# Altium schematic sheet bridge.SchDoc
size 431 x 279 mm; Date: Not shown in title block; ApprovedBy: Not shown in title block; CheckedBy: Not shown in title block; Author: Not shown in title block; CompanyName: Not shown in title block; Engineer: Not shown in title block; Organization: Not shown in title block; Address1: Not shown in title block; Address2: Not shown in title block; Address3: Not shown in title block; Address4: Not shown in title block; DocumentNumber: 3; Revision: Use project parameter SCH_Rev; SheetNumber: 3; SheetTotal: 6; PageSetup: Record=PageOptions|CenterHorizontal=True|CenterVertical=True|PrintScale=1.00|XCorrection=1.00|YCorrection=1.00|PrintKind=0|BorderSize=5000000|LeftOffset=0|BottomOffset=0|Orientation=2|PaperLength=1000|PaperWidth=1000|Scale=100|PaperSource=15|PrintQuality=600|MediaType=1|DitherType=10|PaperKind=Letter|PrintScaleMode=1; CurrentTime: Not shown in title block; CurrentDate: Not shown in title block; Time: Not shown in title block; DocumentFullPathAndName: Not shown in title block; DocumentName: Not shown in title block; ModifiedDate: Not shown in title block; ImagePath: Not shown in title block
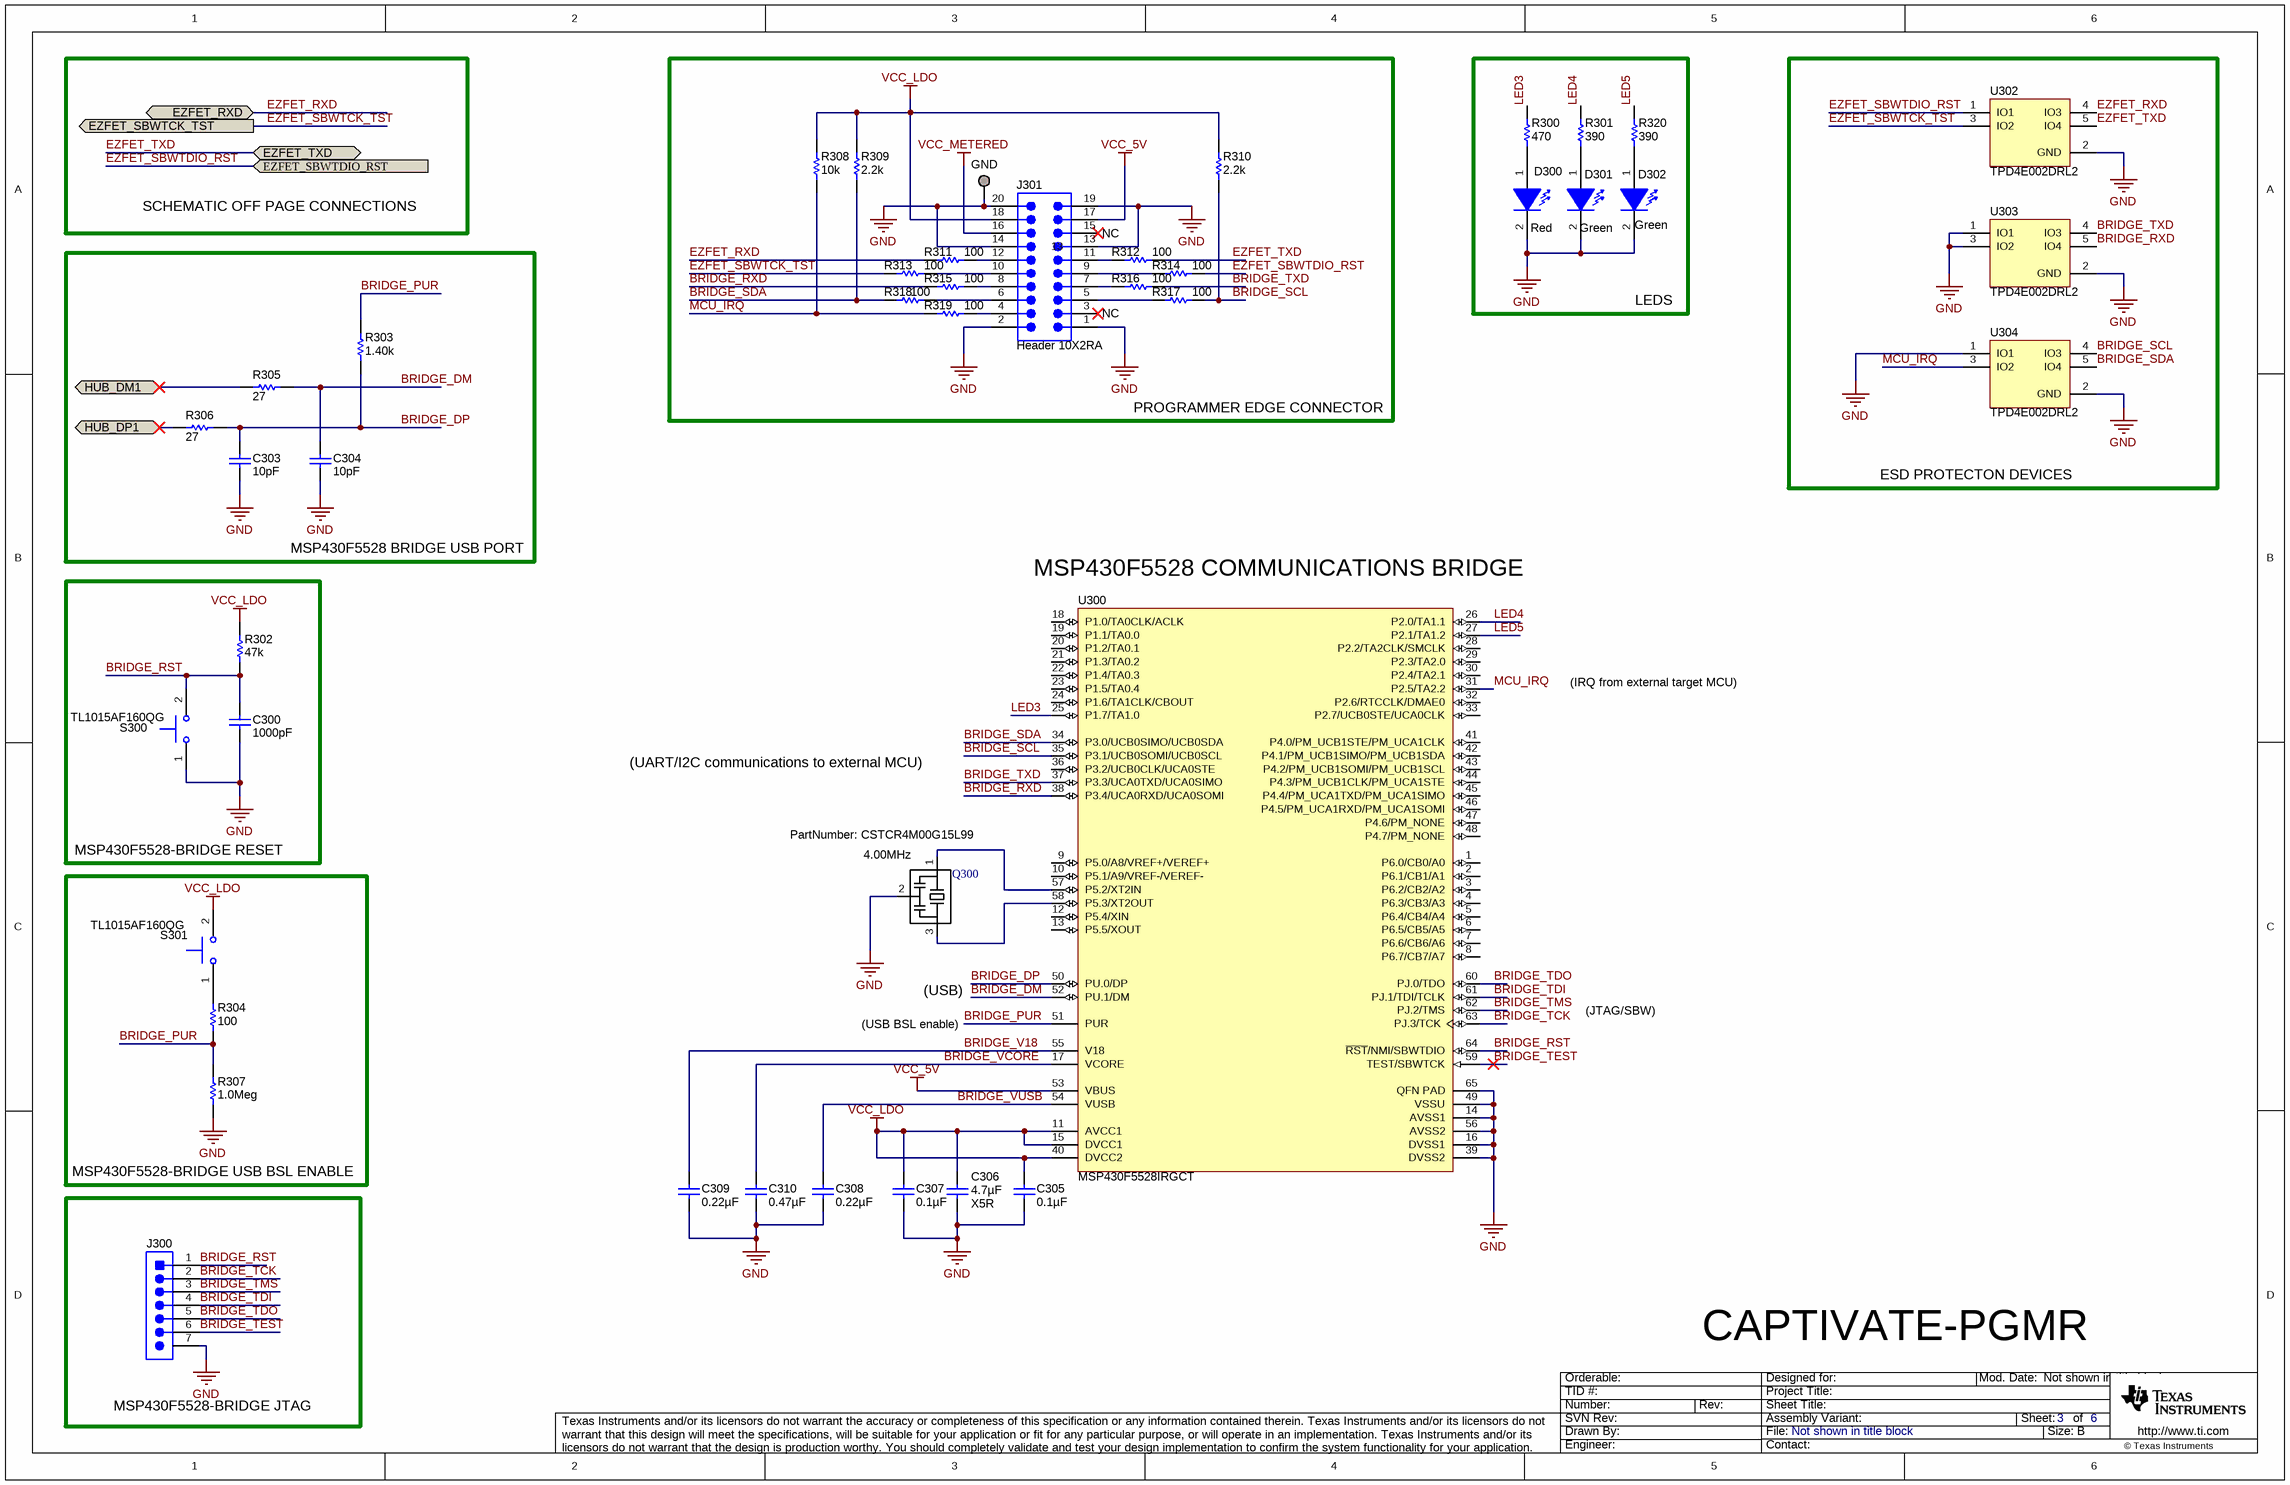
[diagram p0: bridge.SchDoc]

## Parts
C300  ValueDisplayed: 1000pF  [0402]  (hidden comment: C1005X7R1H102K)
C303  ValueDisplayed: 10pF  [0402]  (hidden comment: GRM1555C1H100JA01D)
C304  ValueDisplayed: 10pF  [0402]  (hidden comment: GRM1555C1H100JA01D)
C305  ValueDisplayed: 0.1µF  [0402]  (hidden comment: GRM155R61C104KA88D)
C306  ValueDisplayed: 4.7µF  TempCo: X5R  [0603]  (hidden comment: CGB3B1X5R1A475K055AC)
C307  ValueDisplayed: 0.1µF  [0402]  (hidden comment: GRM155R61C104KA88D)
C308  ValueDisplayed: 0.22µF  [0402]  (hidden comment: GRM155R61A224KE19D)
C309  ValueDisplayed: 0.22µF  [0402]  (hidden comment: GRM155R61A224KE19D)
C310  ValueDisplayed: 0.47µF  [0402]  (hidden comment: GRM155R61A474KE15D)
D300  value Red  [LED_LTST-C190_Red]  (hidden comment: LTST-C190CKT)
D301  value Green  [LED_LTST-C190]  (hidden comment: LTST-C190GKT)
D302  value Green  [LED_LTST-C190]  (hidden comment: LTST-C190GKT)
GND  TESTPOINT  [TP_VIA_060RND040]  (value not drawn)  (no BOM)
J300  GRPB071VWVN-RC  [Sullins_GRPB071VWVN-RC]  (value not drawn)
J301  Header 10X2RA  [HDR2X10RA]
Q300  Value Displayed: 4.00MHz  PartNumber: CSTCR4M00G15L99  [CSTCR CERAMIC RESONATOR - MURATA]  (hidden comment: RATA-FILTER_CSTCR4M00G15)
R300  value 470  [0402]  (hidden comment: CRCW0402470RJNED)
R301  value 390  [0402]  (hidden comment: CRCW0402390RJNED)
R302  value 47k  [0402]  (hidden comment: CRCW040247K0JNED)
R303  value 1.40k  [0402]  (hidden comment: CRCW04021K40FKED)
R304  value 100  [0402]  (hidden comment: CRCW0402100RJNED)
R305  value 27  [0402]  (hidden comment: CRCW040227R0JNED)
R306  value 27  [0402]  (hidden comment: CRCW040227R0JNED)
R307  value 1.0Meg  [0402]  (hidden comment: CRCW04021M00JNED)
R308  ValueDisplayed: 10k  [0402]  (hidden comment: CRCW040210K0JNED)
R309  ValueDisplayed: 2.2k  [0402]  (hidden comment: CRCW04022K20JNED)
R310  ValueDisplayed: 2.2k  [0402]  (hidden comment: CRCW04022K20JNED)
R311  ValueDisplayed: 100  [0402]  (hidden comment: CRCW0402100RJNED)
R312  ValueDisplayed: 100  [0402]  (hidden comment: CRCW0402100RJNED)
R313  ValueDisplayed: 100  [0402]  (hidden comment: CRCW0402100RJNED)
R314  ValueDisplayed: 100  [0402]  (hidden comment: CRCW0402100RJNED)
R315  ValueDisplayed: 100  [0402]  (hidden comment: CRCW0402100RJNED)
R316  ValueDisplayed: 100  [0402]  (hidden comment: CRCW0402100RJNED)
R317  ValueDisplayed: 100  [0402]  (hidden comment: CRCW0402100RJNED)
R318  ValueDisplayed: 100  [0402]  (hidden comment: CRCW0402100RJNED)
R319  ValueDisplayed: 100  [0402]  (hidden comment: CRCW0402100RJNED)
R320  value 390  [0402]  (hidden comment: CRCW0402390RJNED)
S300  TL1015AF160QG  [SW_TL1015AF160QG]
S301  TL1015AF160QG  [SW_TL1015AF160QG]
U300  MSP430F5528IRGCT  [RGC0064B]
U302  TPD4E002DRL2  [DRL0005A]
U303  TPD4E002DRL2  [DRL0005A]
U304  TPD4E002DRL2  [DRL0005A]

## Blocks framed on the sheet
PROGRAMMER EDGE CONNECTOR: GND J301 R308-R319
LEDS: D300-D302 R300 R301 R320
ESD PROTECTON DEVICES: U302-U304
MSP430F5528 BRIDGE USB PORT: C303 C304 R303 R305 R306
MSP430F5528-BRIDGE RESET: C300 R302 S300
MSP430F5528-BRIDGE USB BSL ENABLE: R304 R307 S301
MSP430F5528-BRIDGE JTAG: J300

## Ports
EZFET_RXD (bidir), EZFET_SBWTCK_TST, EZFET_SBWTDIO_RST, EZFET_TXD (bidir), HUB_DM1 (bidir), HUB_DP1 (bidir)

## Nets
GND: C300.2 C303.2 C304.2 C305.2 C306.2 C307.2 C308.2 C309.2 C310.2 D300.2(K) D301.2(K) D302.2(K) GND.1 J300.7 J301.1 J301.2 J301.13 J301.14 J301.19 J301.20 Q300.2 R307.1 S300.1 U300.14(AVSS1) U300.16(DVSS1) U300.39(DVSS2) U300.49(VSSU) U300.56(AVSS2) U300.65(QFN_PAD) U302.2(GND) U303.1(IO1) U303.2(GND) U303.3(IO2) U304.1(IO1) U304.2(GND)
VCC_5V: J301.17 U300.53(VBUS)
VCC_LDO: C305.1 C306.1 C307.1 J301.18 R302.2 R308.2 R309.2 R310.1 S301.2 U300.11(AVCC1) U300.15(DVCC1) U300.40(DVCC2)
VCC_METERED: J301.16
BRIDGE_DM: C304.1 R305.2 U300.52(PU.1/DM)
BRIDGE_DP: C303.1 R303.1 R306.2 U300.50(PU.0/DP)
BRIDGE_PUR: R303.2 R304.1 R307.2 U300.51(PUR)
BRIDGE_RST: C300.1 J300.1 R302.1 S300.2 U300.64(~{RST}/NMI/SBWTDIO)
BRIDGE_RXD: R315.1 U300.38(P3.4/UCA0RXD/UCA0SOMI) U303.5(IO4)
BRIDGE_SCL: R310.2 R317.2 U300.35(P3.1/UCB0SOMI/UCB0SCL) U304.4(IO3)
BRIDGE_SDA: R309.1 R318.1 U300.34(P3.0/UCB0SIMO/UCB0SDA) U304.5(IO4)
BRIDGE_TCK: J300.2 U300.63(PJ.3/TCK)
BRIDGE_TDI: J300.4 U300.61(PJ.1/TDI/TCLK)
BRIDGE_TDO: J300.5 U300.60(PJ.0/TDO)
BRIDGE_TEST: J300.6 U300.59(TEST/SBWTCK)
BRIDGE_TMS: J300.3 U300.62(PJ.2/TMS)
BRIDGE_TXD: R316.2 U300.37(P3.3/UCA0TXD/UCA0SIMO) U303.4(IO3)
BRIDGE_V18: C309.1 U300.55(V18)
BRIDGE_VCORE: C310.1 U300.17(VCORE)
BRIDGE_VUSB: C308.1 U300.54(VUSB)
EZFET_RXD: R311.1 U302.4(IO3) ; port EZFET_RXD
EZFET_SBWTCK_TST: R313.1 U302.3(IO2) ; port EZFET_SBWTCK_TST
EZFET_SBWTDIO_RST: R314.2 U302.1(IO1) ; port EZFET_SBWTDIO_RST
EZFET_TXD: R312.2 U302.5(IO4) ; port EZFET_TXD
HUB_DM1: R305.1 ; port HUB_DM1
HUB_DP1: R306.1 ; port HUB_DP1
LED3: R300.2 U300.25(P1.7/TA1.0)
LED4: R301.2 U300.26(P2.0/TA1.1)
LED5: R320.2 U300.27(P2.1/TA1.2)
MCU_IRQ: R308.1 R319.1 U300.31(P2.5/TA2.2) U304.3(IO2)
NetD300_1: D300.1(A) R300.1
NetD301_1: D301.1(A) R301.1
NetD302_1: D302.1(A) R320.1
NetJ301_4: J301.4 R319.2
NetJ301_5: J301.5 R317.1
NetJ301_6: J301.6 R318.2
NetJ301_7: J301.7 R316.1
NetJ301_8: J301.8 R315.2
NetJ301_9: J301.9 R314.1
NetJ301_10: J301.10 R313.2
NetJ301_11: J301.11 R312.1
NetJ301_12: J301.12 R311.2
NetQ300_1: Q300.1 U300.57(P5.2/XT2IN)
NetQ300_3: Q300.3 U300.58(P5.3/XT2OUT)
NetR304_2: R304.2 S301.1

Not connected (* = marked no-connect by the designer): J301 3* 15*; U300 1(P6.0/CB0/A0) 2(P6.1/CB1/A1) 3(P6.2/CB2/A2) 4(P6.3/CB3/A3) 5(P6.4/CB4/A4) 6(P6.5/CB5/A5) 7(P6.6/CB6/A6) 8(P6.7/CB7/A7) 9(P5.0/A8/VREF+/VEREF+) 10(P5.1/A9/VREF-/VEREF-) 12(P5.4/XIN) 13(P5.5/XOUT) 18(P1.0/TA0CLK/ACLK) 19(P1.1/TA0.0) 20(P1.2/TA0.1) 21(P1.3/TA0.2) 22(P1.4/TA0.3) 23(P1.5/TA0.4) 24(P1.6/TA1CLK/CBOUT) 28(P2.2/TA2CLK/SMCLK) 29(P2.3/TA2.0) 30(P2.4/TA2.1) 32(P2.6/RTCCLK/DMAE0) 33(P2.7/UCB0STE/UCA0CLK) 36(P3.2/UCB0CLK/UCA0STE) 41(P4.0/PM_UCB1STE/PM_UCA1CLK) 42(P4.1/PM_UCB1SIMO/PM_UCB1SDA) 43(P4.2/PM_UCB1SOMI/PM_UCB1SCL) 44(P4.3/PM_UCB1CLK/PM_UCA1STE) 45(P4.4/PM_UCA1TXD/PM_UCA1SIMO) 46(P4.5/PM_UCA1RXD/PM_UCA1SOMI) 47(P4.6/PM_NONE) 48(P4.7/PM_NONE)

## Notes on the sheet
- SCHEMATIC OFF PAGE CONNECTIONS
- NC
- (near U300) MSP430F5528 COMMUNICATIONS BRIDGE
- (IRQ from external target MCU)
- (UART/I2C communications to external MCU)
- (USB BSL enable)
- (USB)
- (JTAG/SBW)
- CAPTIVATE-PGMR
- Drawn By:
- SVN Rev:
- Number:
- TID #:
- Orderable:
- Rev:
- Sheet Title:
- File:
- Project Title:
- Designed for:
- Assembly Variant:
- Mod. Date:
- Sheet:
- Size:
- of
- B
- http://www.ti.com
- Texas Instruments and/or its licensors do not warrant the accuracy or completeness of this specification or any information contained therein. Texas Instruments and/or its licensors do not warrant that this design will meet the specifications, will be suitable for your application or fit for any particular purpose, or will operate in an implementation. Texas Instruments and/or its licensors do not warrant that the design is production worthy. You should completely validate and test your design implementation to confirm the system functionality for your application.
- Engineer:
- Contact:
- © Texas Instruments

## Library data of the parts
C300 = C1005X7R1H102K: CAP, CERM, 1000pF, 50V, +/-10%, X7R, 0402; Manufacturer: TDK; Polarized: N; CompType: Capacitor; U/M: EA; Cap_F: 0.000000001; Tolerance_%: 10; ESR_Ohm: 0.2381; Value1: 0.2381 ohm; VDC_V: 50; TaMin_C: -55; TaMax_C: 125; SymbolVersion: 2008-07-09; Value: 1000pF; PartNumber: C1005X7R1H102K; PackageReference: 0402; RoHS: Y; Value2: 50V; MountType: SMT; Technology: Ceramic; TempCo: X7R; Cap_Case: 0402; Published: 2008-06-19; Publisher: Texas Instruments; LatestRevisionDate: 2013-09-06; ComponentLink1Description: Datasheet link; ComponentLink1URL: http://www.tdk.co.jp/tefe02/e412_c.pdf; Supplier 1: Digi-Key; Supplier Part Number 1: 445-1256-1-ND; Supplier 2: Farnell; Supplier Part Number 2: 1907278
C303 C304 = GRM1555C1H100JA01D: CAP, CERM, 10pF, 50V, +/-5%, C0G/NP0, 0402; Manufacturer: MuRata; Polarized: N; CompType: Capacitor; U/M: EA; Cap_F: 0.00000000001; Tolerance_%: 5; Value1: Unknown; VDC_V: 50; TaMin_C: -55; TaMax_C: 125; SymbolVersion: 2008-07-09; Value: 10pF; PartNumber: GRM1555C1H100JA01D; PackageReference: 0402; RoHS: Y; Value2: 50V; MountType: SMT; Technology: Ceramic; TempCo: C0G/NP0; Cap_Case: 0402; Published: 2008-06-19; Publisher: Texas Instruments; LatestRevisionDate: 2013-09-06; ComponentLink1Description: Datasheet link; ComponentLink1URL: http://search.murata.co.jp/Ceramy/PnsearchViewAction.do?HnOFG=ON&HnNFG=ON&SEL_CNT=50&sLang=en&sKey=GRM1555C1H100JA01D&x=9&y=9&search=startwith; Supplier 1: Mouser; Supplier Part Number 1: 81-GRM1555C1H100JA1D
C305 C307 = GRM155R61C104KA88D: CAP, CERM, 0.1uF, 16V, +/-10%, X5R, 0402; Manufacturer: MuRata; Polarized: N; CompType: Capacitor; U/M: EA; Cap_F: 0.0000001; Tolerance_%: 10; Value1: Unknown; VDC_V: 16; TaMin_C: -55; TaMax_C: 85; SymbolVersion: 2008-07-09; Value: 0.1uF; PartNumber: GRM155R61C104KA88D; PackageReference: 0402; RoHS: Y; Value2: 16V; MountType: SMT; Technology: Ceramic; TempCo: X5R; Cap_Case: 0402; Published: 2008-06-19; Publisher: Texas Instruments; LatestRevisionDate: 2013-09-06; ComponentLink1Description: Datasheet link; ComponentLink1URL: http://search.murata.co.jp/Ceramy/PnsearchViewAction.do?HnOFG=ON&HnNFG=ON&SEL_CNT=50&sLang=en&sKey=GRM155R61C104KA88D&x=9&y=9&search=startwith; Supplier 1: Digi-Key; Supplier Part Number 1: 490-5415-1-ND; Supplier 2: Mouser; Supplier Part Number 2: 81-GRM155R61C104KA8D
C306 = CGB3B1X5R1A475K055AC: CAP, CERM, 4.7 µF, 10 V, +/- 10%, X5R, 0603; Manufacturer: TDK; Polarized: N; CompType: Capacitor; Value: 4.7uF; U/M: EA; Cap_F: 0.0000047; Tolerance_%: 10; Value1: Unknown; VDC_V: 10V; TaMin_C: -55; TaMax_C: 85; SymbolVersion: 2008-07-09; PartNumber: CGB3B1X5R1A475K055AC; PackageReference: 0603; RoHS: Y; Value2: 10V; MountType: SMT; Technology: Ceramic; Cap_Case: 0603; Publisher: Texas Instruments; LatestRevisionDate: 2014-12-04; ComponentLink1Description: Datasheet link; ComponentLink1URL: http://www.tdk.com/pdf/mlcc_product_guide_A12.pdf; Supplier 1: Digi-Key; Supplier Part Number 1: 445-7482-1-ND; Published: 2008-06-19
C308 C309 = GRM155R61A224KE19D: CAP, CERM, 0.22uF, 10V, +/-10%, X5R, 0402; Manufacturer: MuRata; Polarized: N; CompType: Capacitor; U/M: EA; Cap_F: 0.00000022; Tolerance_%: 10; Value1: Unknown; TaMin_C: -55; TaMax_C: 85; SymbolVersion: 2008-07-09; Value: 0.22uF; PartNumber: GRM155R61A224KE19D; PackageReference: 0402; RoHS: Y; VDC_V: 10; Value2: 10V; MountType: SMT; Technology: Ceramic; TempCo: X5R; Cap_Case: 0402; Published: 2008-06-19; Publisher: Texas Instruments; LatestRevisionDate: 2013-09-06; ComponentLink1Description: Datasheet link; ComponentLink1URL: http://search.murata.co.jp/Ceramy/PnsearchViewAction.do?HnOFG=ON&HnNFG=ON&SEL_CNT=50&sLang=en&sKey=GRM155R61A224KE19D&x=9&y=9&search=startwith; Supplier 1: Digi-Key; Supplier Part Number 1: 490-3910-1-ND; Supplier 2: Mouser; Supplier Part Number 2: 81-GRM155R61A224KE19; Supplier 3: Farnell; Supplier Part Number 3: 8819718
C310 = GRM155R61A474KE15D: CAP, CERM, 0.47uF, 10V, +/-10%, X5R, 0402; Manufacturer: MuRata; Polarized: N; CompType: Capacitor; U/M: EA; Cap_F: 0.00000047; Tolerance_%: 10; Value1: Unknown; TaMin_C: -55; TaMax_C: 85; SymbolVersion: 2008-07-09; Value: 0.47uF; PartNumber: GRM155R61A474KE15D; PackageReference: 0402; RoHS: Y; VDC_V: 10; Value2: 10V; MountType: SMT; Technology: Ceramic; TempCo: X5R; Cap_Case: 0402; Published: 2008-06-19; Publisher: Texas Instruments; LatestRevisionDate: 2013-09-06; ComponentLink1Description: Datasheet link; ComponentLink1URL: http://search.murata.co.jp/Ceramy/PnsearchViewAction.do?HnOFG=ON&HnNFG=ON&SEL_CNT=50&sLang=en&sKey=GRM155R61A474KE15D&x=9&y=9&search=startwith; Supplier 1: Digi-Key; Supplier Part Number 1: 490-3264-1-ND; Supplier 2: Mouser; Supplier Part Number 2: 81-GRM155R61A474KE5D; Supplier 3: Farnell; Supplier Part Number 3: 1828863
D300 = LTST-C190CKT: LED, Red, SMD; Manufacturer: Lite-On; Vf_V: 2; Value2: 2V; Io_A: 0.02; Tjmax_C: 85; Power_TotalModule: 0.0625; Value1: 0.0625W; U/M: EA; CompType: LED; PartNumber: LTST-C190CKT; SymbolVersion: 2008-12-08; MountType: SMT; RoHS: Y; PackageReference: Red LED, 1.6x0.8x0.8mm; Type: ?; Color: red; Published: 2008-07-11; Publisher: Texas Instruments; ComponentLink1URL: http://optoelectronics.liteon.com/en-us/api/DwonloadFileHandler.ashx?txtSpecNo=DS-22-98-0009&txtPartNo=LTST-C190CKT; ComponentLink1Description: Datasheet link; LatestRevisionDate: 2013-09-07; Supplier 1: Digi-Key; Supplier Part Number 1: 160-1181-1-ND; Supplier 2: Mouser; Supplier Part Number 2: 859-LTST-C190CKT
D301 D302 = LTST-C190GKT: LED, Green, SMD; Manufacturer: Lite-On; Vf_V: 2.1; Value2: 2.1V; Io_A: 0.02; Power_TotalModule: 0.1; Value1: 0.1W; U/M: EA; CompType: LED; PartNumber: LTST-C190GKT; SymbolVersion: 2008-12-08; MountType: SMT; RoHS: Y; PackageReference: 1.6x0.8x0.8mm; Type: ?; Color: green; Published: 2008-07-11; Publisher: Texas Instruments; ComponentLink1URL: https://sps06.itg.ti.com/sites/KMS/crossdivteams/altium/docs/ComponentDatasheets/LTST-C190GKT.pdf; ComponentLink1Description: Datasheet link; LatestRevisionDate: 2013-09-07; Supplier 1: Digi-Key; Supplier Part Number 1: 160-1183-1-ND; Supplier 2: Mouser; Supplier Part Number 2: 859-LTST-C190GKT
GND = TESTPOINT: TEST POINT.  No entry in BOM.; SymbolVersion: 2010-10-20; CompType: Testpoint; PackageReference: N/A; Publisher: Texas Instruments; LatestRevisionDate: 2014-10-27; LatestRevisionNote: Added Alternate PartNumber and Alternate Manufacturer parameters to appropriate components.
J300 = GRPB071VWVN-RC: Header, 50mil, 7x1, Gold,  TH; Manufacturer: Sullins Connector Solutions; U/M: EA; PartNumber: GRPB071VWVN-RC; PackageReference: Header, 7x1. TH; ClassName: Header; CompType: Header; RoHS: Y; MountType: TH; ComponentLink1Description: Datasheet Link; ComponentLink1URL: http://www.sullinscorp.com/drawings/71_GRPB___1VWVN-RC,_10957-C.pdf; Publisher: Texas Instruments; LatestRevisionDate: 2014-11-26; Supplier 1: Digikey; Supplier Part Number 1: S9014E-07-ND
J301 = Header 10X2RA: Header, Male, 10-Pin, 2 row, Shround, Right Angle; Manufacturer: Samtec; PartNumber: TSSH-110-01-L-D-RA; LatestRevisionDate: 17-Jul-2002; LatestRevisionNote: Re-released for DXP Platform.; Publisher: Altium Limited; Supplier: Samtec
Q300 = MURATA-FILTER_CSTCR4M00G15: 4.00MHz resonator; Supplier 1: Murata; Supplier Part Number 1: CSTCR4M00G15L99
R300 = CRCW0402470RJNED: RES, 470 ohm, 5%, 0.063W, 0402; Manufacturer: Vishay-Dale; CompType: Resistor; Value_Code: 470R; Tolerance_%: 5; Power_W: 0.063; VDC_V: 50; TempCo: 200 ppm/C; EIA_Code: E24; U/M: EA; SymbolVersion: 2009-05-29; PartNumber: CRCW0402470RJNED; PackageReference: 0402; RoHS: Y; Res_ohm: 470; Value1: 5%; Value2: 0.063W; MountType: SMT; Technology: Thick Film; Published: 2008-06-26; Publisher: Texas Instruments; LatestRevisionDate: 2013-01-08; ComponentLink1Description: Datasheet link; ComponentLink1URL: http://www.vishay.com/docs/20035/dcrcwe3.pdf; Supplier 1: Digi-Key; Supplier Part Number 1: 541-470JCT-ND; Supplier 2: Mouser; Supplier Part Number 2: 71-CRCW0402J-470-E3; Supplier 3: Farnell; Supplier Part Number 3: 1537425
R301 R320 = CRCW0402390RJNED: RES, 390 ohm, 5%, 0.063W, 0402; Manufacturer: Vishay-Dale; CompType: Resistor; Value_Code: 390R; Tolerance_%: 5; Power_W: 0.063; VDC_V: 50; TempCo: 200 ppm/C; EIA_Code: E24; U/M: EA; SymbolVersion: 2009-05-29; PartNumber: CRCW0402390RJNED; PackageReference: 0402; RoHS: Y; Res_ohm: 390; Value1: 5%; Value2: 0.063W; MountType: SMT; Technology: Thick Film; Published: 2008-06-26; Publisher: Texas Instruments; LatestRevisionDate: 2013-01-08; ComponentLink1Description: Datasheet link; ComponentLink1URL: http://www.vishay.com/docs/20035/dcrcwe3.pdf; Supplier 1: Digi-Key; Supplier Part Number 1: 541-390JCT-ND; Supplier 2: Mouser; Supplier Part Number 2: 71-CRCW0402J-390-E3; Supplier 3: Farnell; Supplier Part Number 3: 1514701
R302 = CRCW040247K0JNED: RES, 47k ohm, 5%, 0.063W, 0402; Manufacturer: Vishay-Dale; CompType: Resistor; Res_ohm: 47000; Value_Code: 47k0; Tolerance_%: 5; Power_W: 0.063; VDC_V: 50; TempCo: 200 ppm/C; EIA_Code: E24; U/M: EA; SymbolVersion: 2009-05-29; PartNumber: CRCW040247K0JNED; PackageReference: 0402; RoHS: Y; Value1: 5%; Value2: 0.063W; MountType: SMT; Technology: Thick Film; Published: 2008-06-26; Publisher: Texas Instruments; LatestRevisionDate: 2013-01-08; ComponentLink1Description: Datasheet link; ComponentLink1URL: http://www.vishay.com/docs/20035/dcrcwe3.pdf; Supplier 1: Digi-Key; Supplier Part Number 1: 541-47KJCT-ND; Supplier 2: Farnell; Supplier Part Number 2: 1514553; Supplier 3: Newark; Supplier Part Number 3: 52K7099
R303 = CRCW04021K40FKED: RES, 1.40k ohm, 1%, 0.063W, 0402; Manufacturer: Vishay-Dale; CompType: Resistor; Res_ohm: 1400; Value_Code: 1k40; Tolerance_%: 1; Power_W: 0.063; VDC_V: 50; TempCo: 100 ppm/C; EIA_Code: E96; U/M: EA; SymbolVersion: 2009-05-29; PartNumber: CRCW04021K40FKED; PackageReference: 0402; RoHS: Y; Value1: 1%; Value2: 0.063W; MountType: SMT; Technology: Thick Film; Published: 2008-06-26; Publisher: Texas Instruments; LatestRevisionDate: 2013-01-08; ComponentLink1Description: Datasheet link; ComponentLink1URL: http://www.vishay.com/docs/20035/dcrcwe3.pdf; Supplier 1: Digi-Key; Supplier Part Number 1: 541-1.40KLCT-ND; Supplier 2: Mouser; Supplier Part Number 2: 71-CRCW0402-1.4K-E3; Supplier 3: Farnell; Supplier Part Number 3: 1469664
R304 = CRCW0402100RJNED: RES, 100 ohm, 5%, 0.063W, 0402; Manufacturer: Vishay-Dale; CompType: Resistor; Value_Code: 100R; Tolerance_%: 5; Power_W: 0.063; VDC_V: 50; TempCo: 200 ppm/C; EIA_Code: E24; U/M: EA; SymbolVersion: 2009-05-29; PartNumber: CRCW0402100RJNED; PackageReference: 0402; RoHS: Y; Res_ohm: 100; Value1: 5%; Value2: 0.063W; MountType: SMT; Technology: Thick Film; Published: 2008-06-26; Publisher: Texas Instruments; LatestRevisionDate: 2013-01-08; ComponentLink1Description: Datasheet link; ComponentLink1URL: http://www.vishay.com/docs/20035/dcrcwe3.pdf; Supplier 1: Digi-Key; Supplier Part Number 1: 541-100JCT-ND; Supplier 2: Mouser; Supplier Part Number 2: 71-CRCW0402J-100-E3; Supplier 3: Farnell; Supplier Part Number 3: 1652740
R305 R306 = CRCW040227R0JNED: RES, 27 ohm, 5%, 0.063W, 0402; Manufacturer: Vishay-Dale; CompType: Resistor; Value_Code: 27R0; Tolerance_%: 5; Power_W: 0.063; VDC_V: 50; TempCo: 200 ppm/C; EIA_Code: E24; U/M: EA; SymbolVersion: 2009-05-29; PartNumber: CRCW040227R0JNED; PackageReference: 0402; RoHS: Y; Res_ohm: 27; Value1: 5%; Value2: 0.063W; MountType: SMT; Technology: Thick Film; Published: 2008-06-26; Publisher: Texas Instruments; LatestRevisionDate: 2013-01-08; ComponentLink1Description: Datasheet link; ComponentLink1URL: http://www.vishay.com/docs/20035/dcrcwe3.pdf; Supplier 1: Digi-Key; Supplier Part Number 1: 541-27JCT-ND; Supplier 2: Mouser; Supplier Part Number 2: 71-CRCW0402J-27-E3; Supplier 3: Farnell; Supplier Part Number 3: 1514690
R307 = CRCW04021M00JNED: RES, 1.0Meg ohm, 5%, 0.063W, 0402; Manufacturer: Vishay-Dale; CompType: Resistor; Res_ohm: 1000000; Value_Code: 1M00; Tolerance_%: 5; Power_W: 0.063; VDC_V: 50; TempCo: 200 ppm/C; EIA_Code: E24; U/M: EA; SymbolVersion: 2009-05-29; PartNumber: CRCW04021M00JNED; PackageReference: 0402; RoHS: Y; Value1: 5%; Value2: 0.063W; MountType: SMT; Technology: Thick Film; Published: 2008-06-26; Publisher: Texas Instruments; LatestRevisionDate: 2013-01-08; ComponentLink1Description: Datasheet link; ComponentLink1URL: http://www.vishay.com/docs/20035/dcrcwe3.pdf; Supplier 1: Digi-Key; Supplier Part Number 1: 541-1.0MJCT-ND; Supplier 2: Mouser; Supplier Part Number 2: 71-CRCW0402J-1M-E3; Supplier 3: Farnell; Supplier Part Number 3: 1514661
R308 = CRCW040210K0JNED: RES, 10 k, 5%, 0.063 W, 0402; Manufacturer: Vishay-Dale; CompType: Resistor; Value: 10k; Res_ohm: 10000; Value_Code: 10k0; Tolerance_%: 5; Power_W: 0.063; Value2: 0.063W; VDC_V: 50; TempCo: 200 ppm/C; EIA_Code: E24; U/M: EA; SymbolVersion: 2009-05-29; PartNumber: CRCW040210K0JNED; PackageReference: 0402; RoHS: Y; Value1: 5%; MountType: SMT; Technology: Thick Film; Published: 2008-06-26; Publisher: Texas Instruments; LatestRevisionDate: 2014-11-19; ComponentLink1Description: Datasheet link; ComponentLink1URL: http://www.vishay.com/docs/20035/dcrcwe3.pdf; Supplier 1: Digi-Key; Supplier Part Number 1: 541-10KJCT-ND; Supplier 2: Mouser; Supplier Part Number 2: 71-CRCW0402J-10K-E3; Supplier 3: Farnell; Supplier Part Number 3: 1514663
R309 R310 = CRCW04022K20JNED: RES, 2.2 k, 5%, 0.063 W, 0402; Manufacturer: Vishay-Dale; CompType: Resistor; Value: 2.2k; Res_ohm: 2200; Value_Code: 2k20; Tolerance_%: 5; Power_W: 0.063; Value2: 0.063W; VDC_V: 50; TempCo: 200 ppm/C; EIA_Code: E24; U/M: EA; SymbolVersion: 2009-05-29; PartNumber: CRCW04022K20JNED; PackageReference: 0402; RoHS: Y; Value1: 5%; MountType: SMT; Technology: Thick Film; Published: 2008-06-26; Publisher: Texas Instruments; LatestRevisionDate: 2014-11-19; ComponentLink1Description: Datasheet link; ComponentLink1URL: http://www.vishay.com/docs/20035/dcrcwe3.pdf; Supplier 1: Digi-Key; Supplier Part Number 1: 541-2.2KJCT-ND; Supplier 2: Mouser; Supplier Part Number 2: 71-CRCW0402J-2.2K-E3; Supplier 3: Farnell; Supplier Part Number 3: 1514678
R311-R319 = CRCW0402100RJNED: RES, 100, 5%, 0.063 W, 0402; Manufacturer: Vishay-Dale; CompType: Resistor; Value: 100; Value_Code: 100R; Tolerance_%: 5; Power_W: 0.063; Value2: 0.063W; VDC_V: 50; TempCo: 200 ppm/C; EIA_Code: E24; U/M: EA; SymbolVersion: 2009-05-29; PartNumber: CRCW0402100RJNED; PackageReference: 0402; RoHS: Y; Res_ohm: 100; Value1: 5%; MountType: SMT; Technology: Thick Film; Published: 2008-06-26; Publisher: Texas Instruments; LatestRevisionDate: 2014-11-19; ComponentLink1Description: Datasheet link; ComponentLink1URL: http://www.vishay.com/docs/20035/dcrcwe3.pdf; Supplier 1: Digi-Key; Supplier Part Number 1: 541-100JCT-ND; Supplier 2: Mouser; Supplier Part Number 2: 71-CRCW0402J-100-E3; Supplier 3: Farnell; Supplier Part Number 3: 1652740
S300 S301 = TL1015AF160QG: Switch, Tactile, SPST-NO, 0.05A, 12V, SMT; Manufacturer: E-Switch; SymbolCreator: a0412235; VDC_V: 12; SwitchFunction: Off-Mom; PositionCount: 1; CurrentRating_mA: 50; SymbolVersion: 2012-10-29; PartNumber: TL1015AF160QG; MountType: SMT; ComponentLink1Description: Datasheet URL; ComponentLink1URL: http://spec.e-switch.com/P-J/P420000.pdf; RoHS: Y; Circuit: SPST-NO; Orientation: Top Actuated; CompType: Switch; PackageReference: Switch, 4.4x2x2.9 mm; Publisher: Texas Instruments; LatestRevisionDate: 2014-12-08; Supplier 1: Digi-Key; Supplier Part Number 1: EG4344CT-ND; Supplier 2: Mouser; Supplier Part Number 2: 612-TL1015AF; Supplier 3: Farnell; Supplier Part Number 3: 2292962
U300 = MSP430F5528IRGCT: 25 MHz Mixed Signal Microcontroller with 128 KB Flash, 8192 B SRAM and 47 GPIOs, -40 to 85 degC, 64-pin QFN (RGC), Green (RoHS & no Sb/Br); Manufacturer: Texas Instruments; ADC: 12-bit SAR; ADC Channels: 16; Brown Out Reset: Yes; DMA: 3; Flash(KB): 128; Frequency(MHz): 25; GPIO: 47; Multiplier: 32x32; SRAM(B): 8192; SubFamily: 5 Series; Timers - 16-bit: 4; USB: 1; USCI_A (UART/LIN/IrDA/SPI): 2; DatasheetVersion: SLAS590I; PackageVersion: 4204106/F; PackageReference: RGC0064B; PackageDescription: 64-Pin Plastic Flat Pack, Body 9 x 9 mm, Pitch 0.5 mm; Supplier 1: Digi-Key; Supplier Part Number 1: 296-27930-2-ND; Supplier 2: Digi-Key; Supplier Part Number 2: 296-27930-1-ND; Supplier 3: Digi-Key; Supplier Part Number 3: 296-27930-6-ND; Supplier 4: Newark; Supplier Part Number 4: 74R6474; Supplier 5: Mouser; Supplier Part Number 5: 595-MSP430F5528IRGCR; Comparators: Yes; Eco-Plan: Green (RoHS & no Sb/Br); Real-Time Clock: Yes; SVS: Yes; Temp Sensor: Yes; USCI_B (I2C & SPI): 2; Watchdog: Yes; Mounting Technology: Surface Mount; PartNumber: MSP430F5528IRGCT; ComponentLink1Description: Manufacturer URL; ComponentLink1URL: http://www.ti.com/; ComponentLink2Description: Datasheet; ComponentLink2URL: http://www.ti.com/general/docs/lit/getliterature.tsp?genericPartNumber=MSP430F5528&fileType=pdf; ComponentLink3Description: Package Specification; ComponentLink3URL: http://www.ti.com/lit/ds/symlink/ucd3138.pdf
U302-U304 = TPD4E002DRL2: Low-Capacitance Array with + / - 15 kV ESD Protection, 4 Channels, -40 to +85 degC, 5-pin SOT (DRL), Green (RoHS & no Sb/Br); Manufacturer: Texas Instruments; Alternate Manufacturer: None; Alternate PartNumber: Equivalent; Breakdown Voltage(Min)(V): 6; IEC 61000-4-2 Air-Gap(+/- kV): 15; IO Capacitance(Typ)(pF): 11; IO Leakage Current(nA): 100; SubFamily: ESD Solution; DatasheetVersion: SLVS615D; PackageVersion: revD, Aug-2007; PackageReference: DRL0005A; PackageDescription: 5-Pin Plastic Small Outline, Flat Lead 0.5 mm Pitch; Supplier 1: Digi-Key; Supplier Part Number 1: 296-25866-2-ND; Supplier 2: Digi-Key; Supplier Part Number 2: 296-25866-1-ND; Supplier 3: Digi-Key; Supplier Part Number 3: 296-25866-6-ND; Supplier 4: Newark; Supplier Part Number 4: 69R0434; Supplier 5: Mouser; Supplier Part Number 5: 595-TPD4E002DRL2; Eco-Plan: Green (RoHS & no Sb/Br); IEC 61000-4-2 Contact(+/- kV): 15; MountType: SMT; PartNumber: TPD4E002DRL2; ComponentLink1Description: Datasheet; ComponentLink1URL: http://www.ti.com/general/docs/lit/getliterature.tsp?genericPartNumber=TPD4E002&fileType=pdf; ComponentLink2Description: URL Link1; ComponentLink2URL: SamplesURL:http://www.ti.com/product/tpd4e002#samples